# EAGLE design BURPS-v1.1 (EAGLE 5.12)
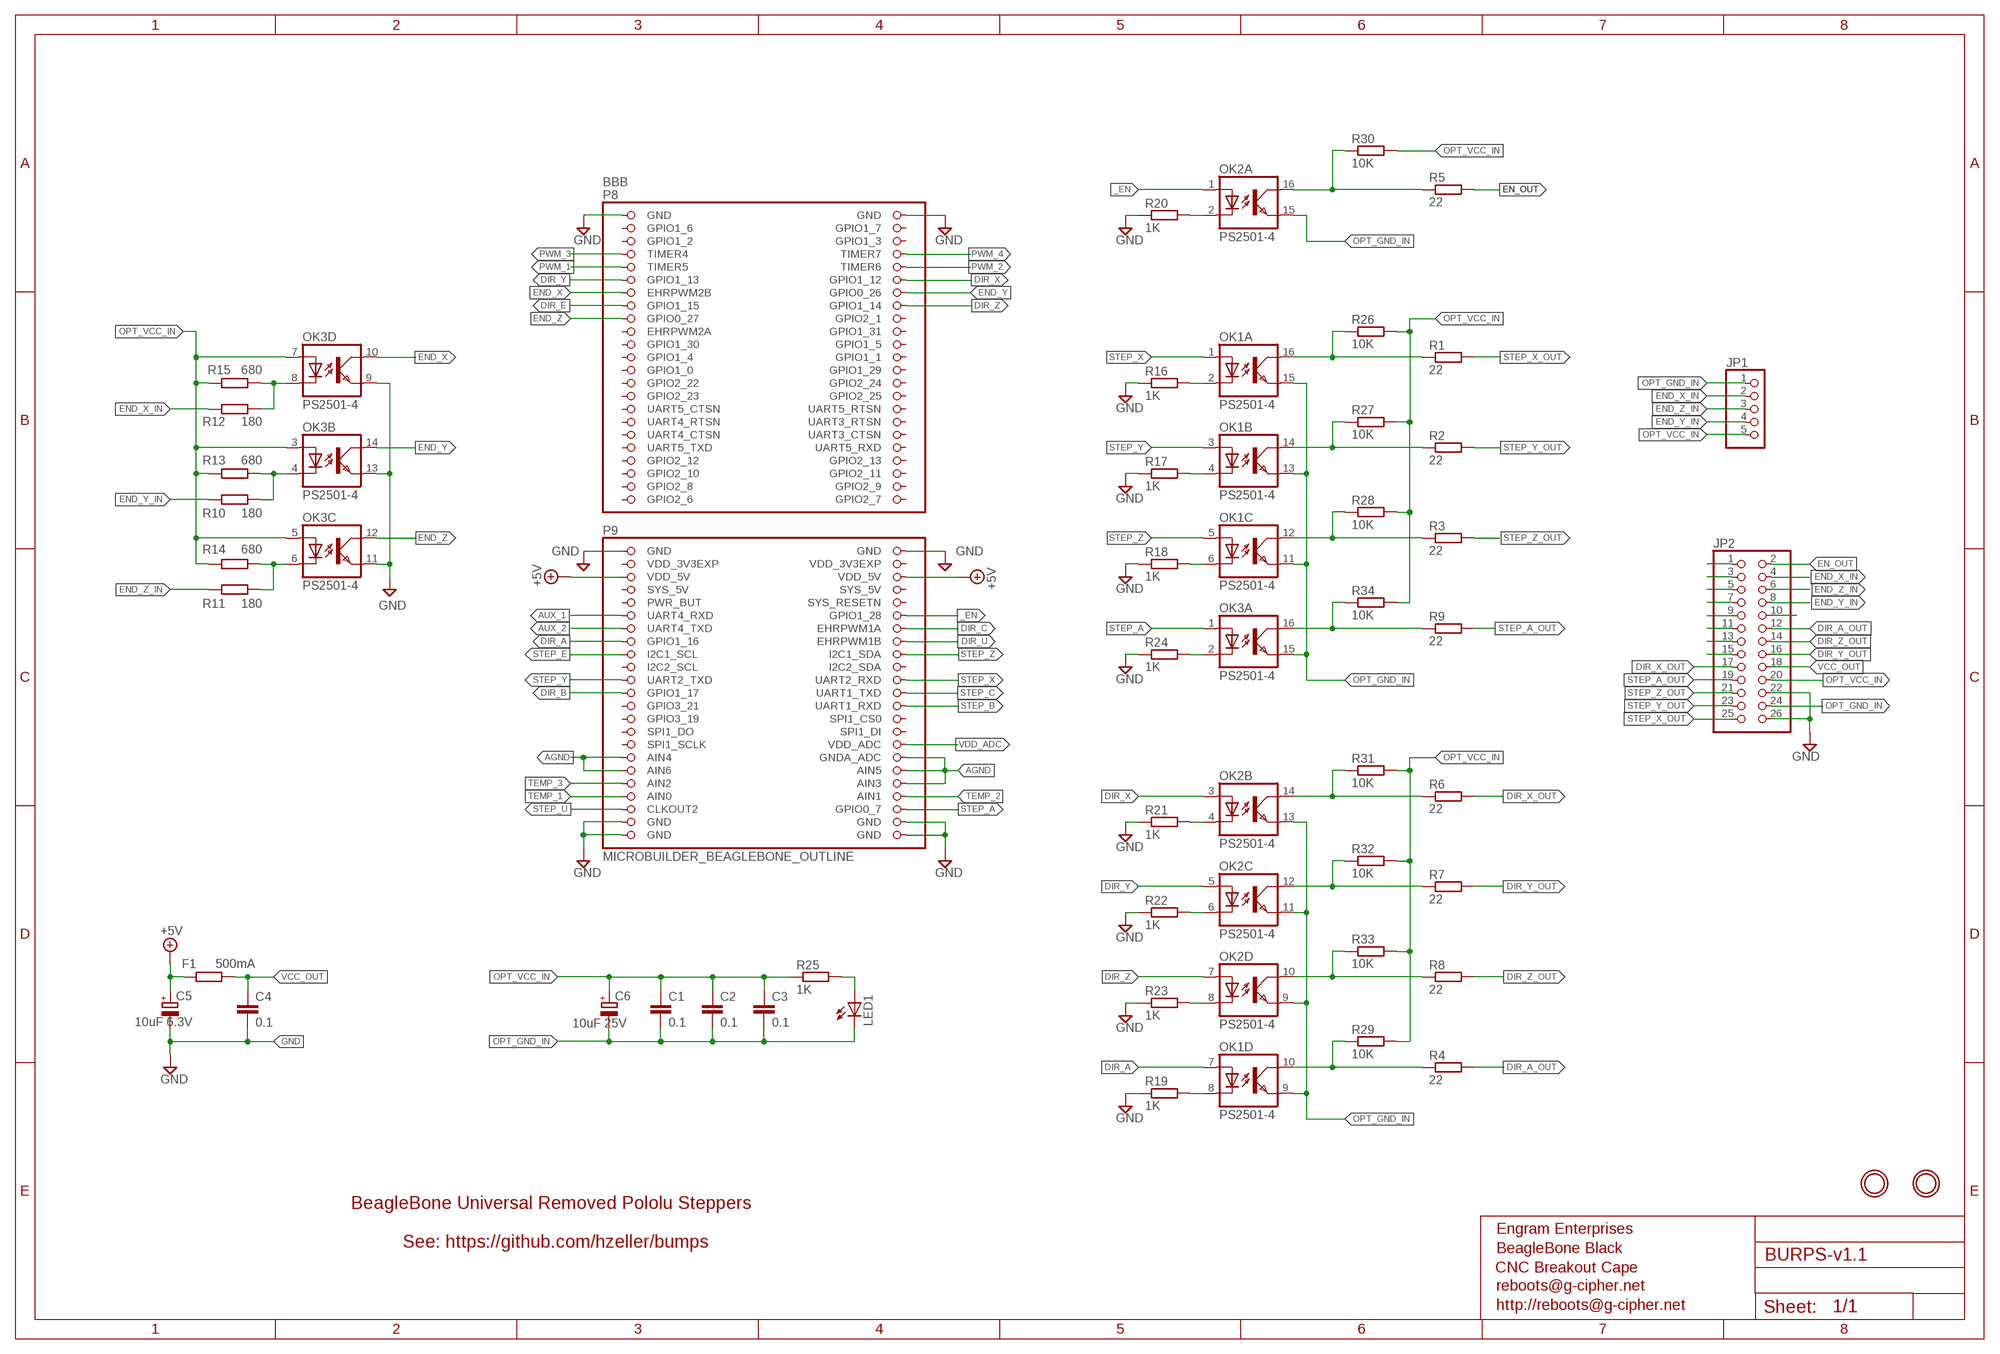
[diagram p0: schematic, sheet 1]

## Parts
BBB  MICROBUILDER_BEAGLEBONE_OUTLINE  [MICROBUILDER_BEAGLEBONE_SHIELD]
C1  0.1  C-EUC0805  [C0805]
C2  0.1  C-EUC0805  [C0805]
C3  0.1  C-EUC0805  [C0805]
C4  0.1  C-EUC0805  [C0805]
C5  10uF 6.3V  CPOL-EUC  [PANASONIC_C]
C6  10uF 25V  CPOL-EUC  [PANASONIC_C]
F1  500mA  R-EU_R1206  [R1206]
JP1  PINHD-1X5  [1X05]
JP2  PINHD-2X13  [2X13]
LED1  LEDCHIPLED_0805  [CHIPLED_0805]
OK1  PS2501-4  PC847  [DIL16]
OK2  PS2501-4  PC847  [DIL16]
OK3  PS2501-4  PC847  [DIL16]
R1  22  R-EU_R0805  [R0805]
R2  22  R-EU_R0805  [R0805]
R3  22  R-EU_R0805  [R0805]
R4  22  R-EU_R0805  [R0805]
R5  22  R-EU_R0805  [R0805]
R6  22  R-EU_R0805  [R0805]
R7  22  R-EU_R0805  [R0805]
R8  22  R-EU_R0805  [R0805]
R9  22  R-EU_R0805  [R0805]
R10  180  R-EU_R0805  [R0805]
R11  180  R-EU_R0805  [R0805]
R12  180  R-EU_R0805  [R0805]
R13  680  R-EU_R0805  [R0805]
R14  680  R-EU_R0805  [R0805]
R15  680  R-EU_R0805  [R0805]
R16  1K  R-EU_R0805  [R0805]
R17  1K  R-EU_R0805  [R0805]
R18  1K  R-EU_R0805  [R0805]
R19  1K  R-EU_R0805  [R0805]
R20  1K  R-EU_R0805  [R0805]
R21  1K  R-EU_R0805  [R0805]
R22  1K  R-EU_R0805  [R0805]
R23  1K  R-EU_R0805  [R0805]
R24  1K  R-EU_R0805  [R0805]
R25  1K  R-EU_R0805  [R0805]
R26  10K  R-EU_R0805  [R0805]
R27  10K  R-EU_R0805  [R0805]
R28  10K  R-EU_R0805  [R0805]
R29  10K  R-EU_R0805  [R0805]
R30  10K  R-EU_R0805  [R0805]
R31  10K  R-EU_R0805  [R0805]
R32  10K  R-EU_R0805  [R0805]
R33  10K  R-EU_R0805  [R0805]
R34  10K  R-EU_R0805  [R0805]
U$22  MOUNTINGHOLE3.0THIN  [MOUNTINGHOLE_3.0_PLATEDTHIN]
U$23  MOUNTINGHOLE3.0THIN  [MOUNTINGHOLE_3.0_PLATEDTHIN]

## Nets
+5V: BBB.51(VDD_5V) BBB.52(VDD_5V) C5.+ F1.1
_EN: BBB.58(GPIO1_28) OK2.1(A:A)
AGND: BBB.79(AIN4) BBB.80(GNDA_ADC) BBB.81(AIN6) BBB.82(AIN5) BBB.84(AIN3)
AUX_1: BBB.57(UART4_RXD)
AUX_2: BBB.59(UART4_TXD)
DIR_A: BBB.61(GPIO1_16) OK1.7(D:A)
DIR_A_OUT: JP2.12 R4.2
DIR_B: BBB.69(GPIO1_17)
DIR_C: BBB.60(EHRPWM1A)
DIR_E: BBB.15(GPIO1_15)
DIR_U: BBB.62(EHRPWM1B)
DIR_X: BBB.12(GPIO1_12) OK2.3(B:A)
DIR_X_OUT: JP2.17 R6.2
DIR_Y: BBB.11(GPIO1_13) OK2.5(C:A)
DIR_Y_OUT: JP2.16 R7.2
DIR_Z: BBB.16(GPIO1_14) OK2.7(D:A)
DIR_Z_OUT: JP2.14 R8.2
EN_OUT: JP2.2 R5.2
END_X: BBB.13(EHRPWM2B) OK3.10(D:COL)
END_X_IN: JP1.2 JP2.4 R12.1
END_Y: BBB.14(GPIO0_26) OK3.14(B:COL)
END_Y_IN: JP1.4 JP2.8 R10.1
END_Z: BBB.17(GPIO0_27) OK3.12(C:COL)
END_Z_IN: JP1.3 JP2.6 R11.1
GND: BBB.1(GND) BBB.2(GND) BBB.47(GND) BBB.48(GND) BBB.89(GND) BBB.90(GND) BBB.91(GND) BBB.92(GND) C4.2 C5.- JP2.22 JP2.26 OK3.9(D:EMIT) OK3.11(C:EMIT) OK3.13(B:EMIT) R16.1 R17.1 R18.1 R19.1 R20.1 R21.1 R22.1 R23.1 R24.1
IN1: JP2.9
IN2: JP2.13
IN3: JP2.15
IN6: JP2.10
N$1: OK3.2(A:C) R24.2
N$2: OK1.2(A:C) R16.2
N$3: OK1.4(B:C) R17.2
N$4: OK1.6(C:C) R18.2
N$5: OK2.4(B:C) R21.2
N$6: OK2.6(C:C) R22.2
N$7: OK2.8(D:C) R23.2
N$8: OK1.8(D:C) R19.2
N$9: OK3.6(C:C) R11.2 R14.2
N$10: LED1.A R25.2
N$11: OK2.2(A:C) R20.2
N$12: OK3.4(B:C) R10.2 R13.2
N$13: OK3.8(D:C) R12.2 R15.2
N$14: OK2.14(B:COL) R6.1 R31.1
N$15: OK2.12(C:COL) R7.1 R32.1
N$16: OK2.10(D:COL) R8.1 R33.1
N$17: OK1.10(D:COL) R4.1 R29.1
N$18: OK3.16(A:COL) R9.1 R34.1
N$19: OK1.16(A:COL) R1.1 R26.1
N$20: OK1.14(B:COL) R2.1 R27.1
N$21: OK1.12(C:COL) R3.1 R28.1
N$22: JP2.11
N$24: OK2.16(A:COL) R5.1 R30.1
OPT_GND_IN: C1.2 C2.2 C3.2 C6.- JP1.1 JP2.24 LED1.C OK1.9(D:EMIT) OK1.11(C:EMIT) OK1.13(B:EMIT) OK1.15(A:EMIT) OK2.9(D:EMIT) OK2.11(C:EMIT) OK2.13(B:EMIT) OK2.15(A:EMIT) OK3.15(A:EMIT)
OPT_VCC_IN: C1.1 C2.1 C3.1 C6.+ JP1.5 JP2.20 OK3.3(B:A) OK3.5(C:A) OK3.7(D:A) R13.1 R14.1 R15.1 R25.1 R26.2 R27.2 R28.2 R29.2 R30.2 R31.2 R32.2 R33.2 R34.2
OUT5: JP2.1
OUT6: JP2.3
OUT7: JP2.5
OUT8: JP2.7
PWM_1: BBB.9(TIMER5)
PWM_2: BBB.10(TIMER6)
PWM_3: BBB.7(TIMER4)
PWM_4: BBB.8(TIMER7)
STEP_A: BBB.88(GPIO0_7) OK3.1(A:A)
STEP_A_OUT: JP2.19 R9.2
STEP_B: BBB.72(UART1_RXD)
STEP_C: BBB.70(UART1_TXD)
STEP_E: BBB.63(I2C1_SCL)
STEP_U: BBB.87(CLKOUT2)
STEP_X: BBB.68(UART2_RXD) OK1.1(A:A)
STEP_X_OUT: JP2.25 R1.2
STEP_Y: BBB.67(UART2_TXD) OK1.3(B:A)
STEP_Y_OUT: JP2.23 R2.2
STEP_Z: BBB.64(I2C1_SDA) OK1.5(C:A)
STEP_Z_OUT: JP2.21 R3.2
TEMP_1: BBB.85(AIN0)
TEMP_2: BBB.86(AIN1)
TEMP_3: BBB.83(AIN2)
VCC_OUT: C4.1 F1.2 JP2.18
VDD_ADC: BBB.78(VDD_ADC)
Unconnected: BBB.5(GPIO1_2) BBB.6(GPIO1_3) BBB.18(GPIO2_1) BBB.19(EHRPWM2A) BBB.20(GPIO1_31) BBB.21(GPIO1_30) BBB.22(GPIO1_5) BBB.23(GPIO1_4) BBB.24(GPIO1_1) BBB.25(GPIO1_0) BBB.26(GPIO1_29) BBB.27(GPIO2_22) BBB.28(GPIO2_24) BBB.29(GPIO2_23) BBB.30(GPIO2_25) BBB.31(UART5_CTSN) BBB.32(UART5_RTSN) BBB.33(UART4_RTSN) BBB.34(UART3_RTSN) BBB.35(UART4_CTSN) BBB.36(UART3_CTSN) BBB.37(UART5_TXD) BBB.38(UART5_RXD) BBB.39(GPIO2_12) BBB.40(GPIO2_13) BBB.41(GPIO2_10) BBB.53(SYS_5V) BBB.54(SYS_5V) BBB.55(PWR_BUT) BBB.56(SYS_RESETN) BBB.65(I2C2_SCL) BBB.66(I2C2_SDA) BBB.71(GPIO3_21) BBB.73(GPIO3_19) BBB.74(SPI1_CS0) BBB.75(SPI1_DO) BBB.76(SPI1_DI) BBB.77(SPI1_SCLK)

## Notes on the sheet
- BeagleBone Universal Removed Pololu Steppers
- Engram Enterprises
- See: https://github.com/hzeller/bumps
- BeagleBone Black
- CNC Breakout Cape
- reboots@g-cipher.net
- http://reboots@g-cipher.net

## Power pins joined to a net without a drawn wire
GPIO1_6: BBB.3(GPIO1_6)
GPIO1_7: BBB.4(GPIO1_7)
GPIO2_6: BBB.45(GPIO2_6)
GPIO2_7: BBB.46(GPIO2_7)
GPIO2_8: BBB.43(GPIO2_8)
GPIO2_9: BBB.44(GPIO2_9)
GPIO2_11: BBB.42(GPIO2_11)
VDD_3V3EXP: BBB.49(VDD_3V3EXP) BBB.50(VDD_3V3EXP)

## Library data of the parts
BBB = BURPS-v0.1:MICROBUILDER_BEAGLEBONE_OUTLINE
C1-C4 = rcl:C-EU: CAPACITOR, European symbol
C5 C6 = rcl:CPOL-EU: POLARIZED CAPACITOR, European symbol
F1 R1-R34 = rcl:R-EU_: RESISTOR, European symbol
JP1 = pinhead:PINHD-1X5: PIN HEADER
JP2 = pinhead:PINHD-2X13: PIN HEADER
LED1 = led:LED: LED OSRAM: - CHIPLED LG R971, LG N971, LY N971, LG Q971, LY Q971, LO R971, LY R971 LH N974, LH R974 LS Q976, LO Q976, LY Q976 LO Q996 - Hyper CHIPLED LW Q18S LB Q993, LB Q99A, LB R99A - SideLED LS A670, LO A670, LY A670, LG A670, LP A670 LB A673, LV A673, LT A673, LW A673 LH A674 LY A675 LS A676, LA A676, LO A676, LY A676, LW A676 LS A679, LY A679, LG A679 - Hyper Micro SIDELED® LS Y876, LA Y876, LO Y876, LY Y876 LT Y87S - SmartLED LW L88C, LW L88S LB L89C, LB L89S, LG L890 LS L89K, LO L89K, LY L89K LS L896, LA L896, LO L896, LY L896 - TOPLED LS T670, LO T670, LY T670, LG T670, LP T670 LSG T670, LSP T670, LSY T670, LOP T670, LYG T670 LG T671, LOG T671, LSG T671 LB T673, LV T673, LT T673, LW T673 LH T674 LS T676, LA T676, LO T676, LY T676, LB T676, LH T676, LSB T676, LW T676 LB T67C, LV T67C, LT T67C, LS T67K, LO T67K, LY T67K, LW E67C LS E67B, LA E67B, LO E67B, LY E67B, LB E67C, LV E67C, LT E67C LW T67C LS T679, LY T679, LG T679 LS T770, LO T770, LY T770, LG T770, LP T770 LB T773, LV T773, LT T773, LW T773 LH T774 LS E675, LA E675, LY E675, LS T675 LS T776, LA T776, LO T776, LY T776, LB T776 LHGB T686 LT T68C, LB T68C - Hyper Mini TOPLED® LB M676 - Mini TOPLED Santana® LG M470 LS M47K, LO M47K, LY M47K Source: http://www.osram.convergy.de LUXEON: - LUMILED® LXK2-PW12-R00, LXK2-PW12-S00, LXK2-PW14-U00, LXK2-PW14-V00 LXK2-PM12-R00, LXK2-PM12-S00, LXK2-PM14-U00 LXK2-PE12-Q00, LXK2-PE12-R00, LXK2-PE12-S00, LXK2-PE14-T00, LXK2-PE14-U00 LXK2-PB12-K00, LXK2-PB12-L00, LXK2-PB12-M00, LXK2-PB14-N00, LXK2-PB14-P00, LXK2-PB14-Q00 LXK2-PR12-L00, LXK2-PR12-M00, LXK2-PR14-Q00, LXK2-PR14-R00 LXK2-PD12-Q00, LXK2-PD12-R00, LXK2-PD12-S00 LXK2-PH12-R00, LXK2-PH12-S00 LXK2-PL12-P00, LXK2-PL12-Q00, LXK2-PL12-R00 Source: www.luxeon.com KINGBRIGHT: KA-3528ASYC Source: www.kingbright.com
OK1-OK3 = optocoupler:PC847: SHARP OPTO COUPLER; OC_FARNELL: 9707735; OC_NEWARK: unknown
U$22 U$23 = microbuilder:MOUNTINGHOLE: Mounting Hole

## Board
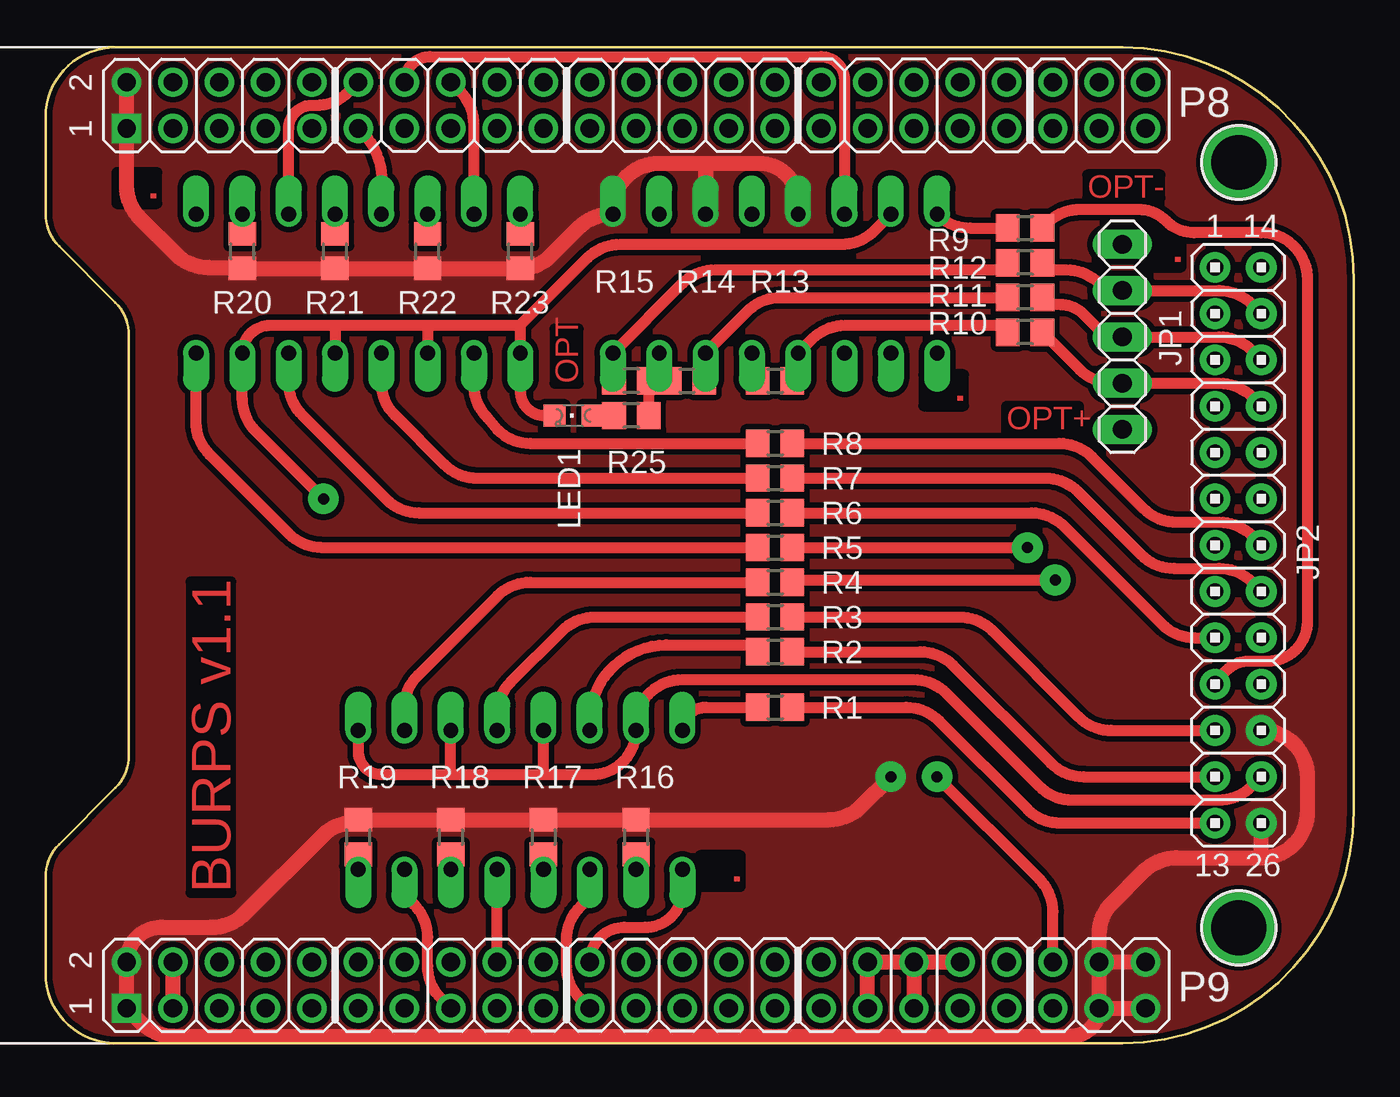
[diagram p1: board, top side]
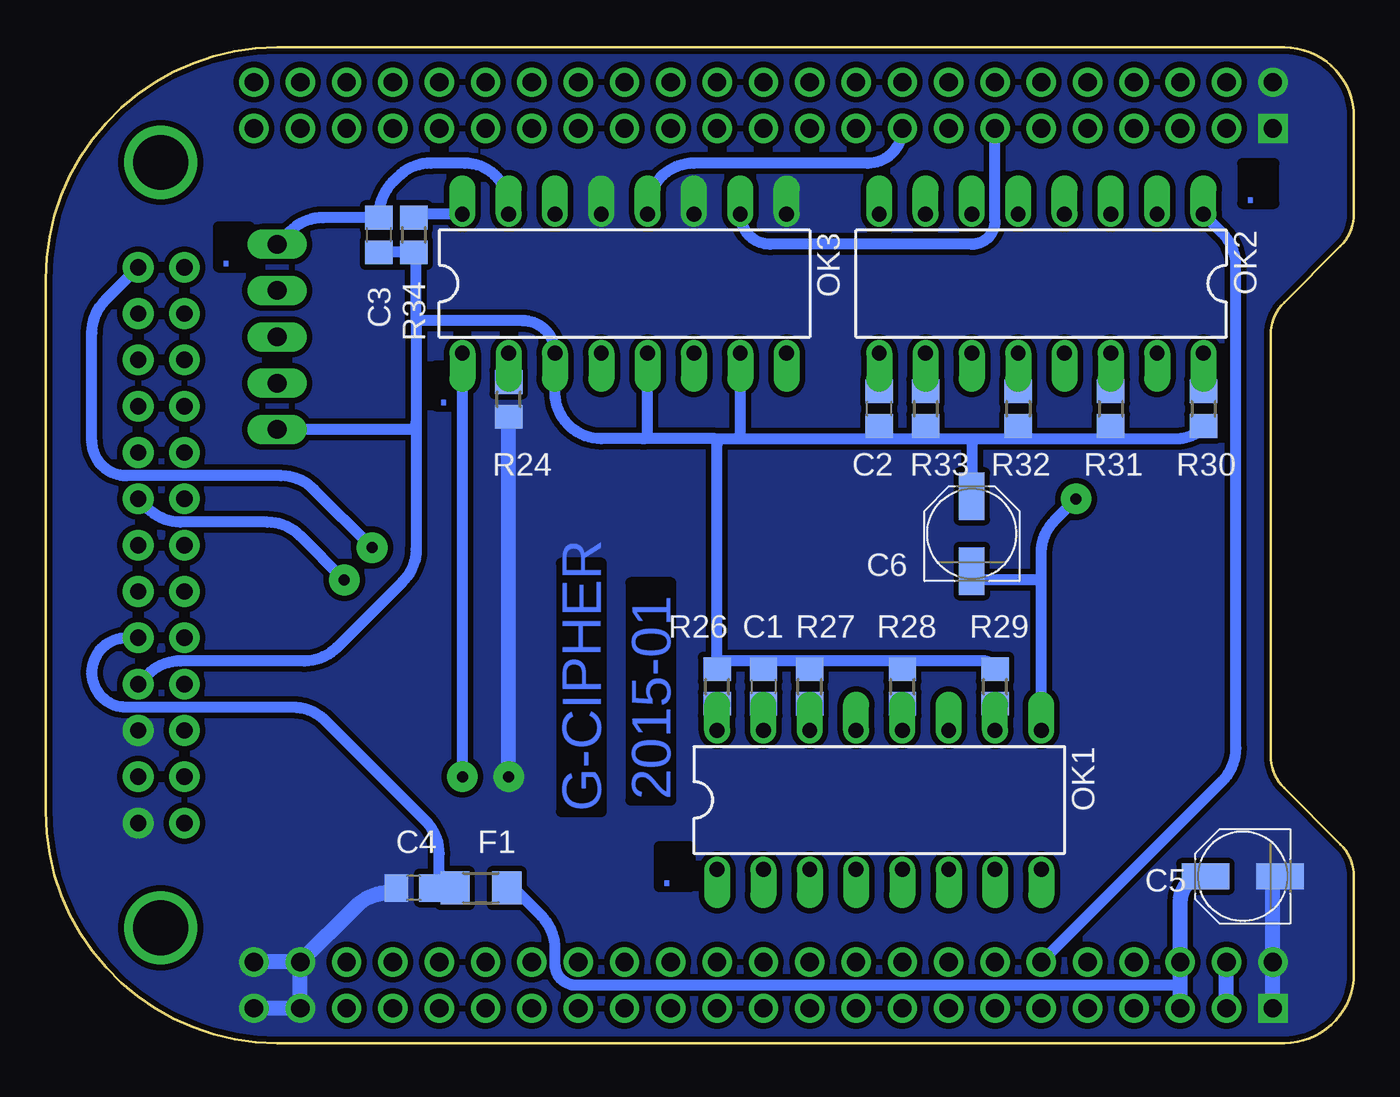
[diagram p2: board, bottom side, seen from below]

Size 71.75 x 54.61 mm. Coordinates in mm from the lower left corner, seen from the top.
Outline: 3.81,54.61 59.05,54.61 arc-90 71.75,41.91 71.75,12.7 arc-90 59.05,0 3.81,0 arc-90 0,3.81 0,9.11 arc-45 0.74,10.9 3.83,13.99 arc45 4.57,15.78 4.57,38.83 arc45 3.83,40.62 0.74,43.71 arc-45 0,45.5 0,50.8 arc-90 3.81,54.61
Copper layers (1*16): Top 0.035mm / dielectric 1.5mm / Bottom 0.035mm
Design rules "SparkFun10mil": minimum track width 10mil, minimum drill 20mil, track to track 10mil, track to pad 10mil, pad to pad 10mil, via to via 10mil, smd to smd 10mil, copper to edge 10mil, drill to drill 10mil, minimum pad ring 12mil, minimum via ring 10mil, stop-mask expansion 4mil, vias tented up to drill 25mil, thermal gap 10mil

### Footprints (pad centres in the part's own frame; a part is rotated, then mirrored left to right if it is on the bottom)
MICROBUILDER_BEAGLEBONE_SHIELD = drill 1 square: 1 4.445,19.05; 47 52.705,19.05 | drill 1 round: 2 1.905,19.05; 3 4.445,21.59; 4 1.905,21.59; 5 4.445,24.13; 6 1.905,24.13; 7 4.445,26.67; 8 1.905,26.67; 9 4.445,29.21; 10 1.905,29.21; 11 4.445,31.75; 12 1.905,31.75; 13 4.445,34.29; 14 1.905,34.29; 15 4.445,36.83; 16 1.905,36.83; 17 4.445,39.37; 18 1.905,39.37; 19 4.445,41.91; 20 1.905,41.91; 21 4.445,44.45; 22 1.905,44.45; 23 4.445,46.99; 24 1.905,46.99; 25 4.445,49.53; 26 1.905,49.53; 27 4.445,52.07; 28 1.905,52.07; 29 4.445,54.61; 30 1.905,54.61; 31 4.445,57.15; 32 1.905,57.15; 33 4.445,59.69; 34 1.905,59.69; 35 4.445,62.23; 36 1.905,62.23; 37 4.445,64.77; 38 1.905,64.77; 39 4.445,67.31; 40 1.905,67.31; 41 4.445,69.85; 42 1.905,69.85; 43 4.445,72.39; 44 1.905,72.39; 45 4.445,74.93; 46 1.905,74.93; 48 50.165,19.05; 49 52.705,21.59; 50 50.165,21.59; 51 52.705,24.13; 52 50.165,24.13; 53 52.705,26.67; 54 50.165,26.67; 55 52.705,29.21; 56 50.165,29.21; 57 52.705,31.75; 58 50.165,31.75; 59 52.705,34.29; 60 50.165,34.29; 61 52.705,36.83; 62 50.165,36.83; 63 52.705,39.37; 64 50.165,39.37; 65 52.705,41.91; 66 50.165,41.91; 67 52.705,44.45; 68 50.165,44.45; 69 52.705,46.99; 70 50.165,46.99; 71 52.705,49.53; 72 50.165,49.53; 73 52.705,52.07; 74 50.165,52.07; 75 52.705,54.61; 76 50.165,54.61; 77 52.705,57.15; 78 50.165,57.15; 79 52.705,59.69; 80 50.165,59.69; 81 52.705,62.23; 82 50.165,62.23; 83 52.705,64.77; 84 50.165,64.77; 85 52.705,67.31; 86 50.165,67.31; 87 52.705,69.85; 88 50.165,69.85; 89 52.705,72.39; 90 50.165,72.39; 91 52.705,74.93; 92 50.165,74.93
C0805 = smd 1.3 x 1.5: 1 -0.95,0; 2 0.95,0
PANASONIC_C = smd 2.6 x 1.4: + 2.05,0; - -2.05,0
R1206 = smd 1.6 x 1.803: 1 -1.422,0; 2 1.422,0
1X05 = drill 1.016 long: 1 -5.08,0; 2 -2.54,0; 3 0,0; 4 2.54,0; 5 5.08,0
2X13 = drill 0.9 pad 1.676 round: 1 -15.24,-1.27; 2 -15.24,1.27; 3 -12.7,-1.27; 4 -12.7,1.27; 5 -10.16,-1.27; 6 -10.16,1.27; 7 -7.62,-1.27; 8 -7.62,1.27; 9 -5.08,-1.27; 10 -5.08,1.27; 11 -2.54,-1.27; 12 -2.54,1.27; 13 0,-1.27; 14 0,1.27; 15 2.54,-1.27; 16 2.54,1.27; 17 5.08,-1.27; 18 5.08,1.27; 19 7.62,-1.27; 20 7.62,1.27; 21 10.16,-1.27; 22 10.16,1.27; 23 12.7,-1.27; 24 12.7,1.27; 25 15.24,-1.27; 26 15.24,1.27
CHIPLED_0805 = smd 1.2 x 1.2: A 0,-1.05; C 0,1.05
DIL16 = drill 0.813 offset: 1 -8.89,-3.81; 2 -6.35,-3.81; 3 -3.81,-3.81; 4 -1.27,-3.81; 5 1.27,-3.81; 6 3.81,-3.81; 7 6.35,-3.81; 8 8.89,-3.81; 9 8.89,3.81; 10 6.35,3.81; 11 3.81,3.81; 12 1.27,3.81; 13 -1.27,3.81; 14 -3.81,3.81; 15 -6.35,3.81; 16 -8.89,3.81
R0805 = smd 1.3 x 1.5: 1 -0.95,0; 2 0.95,0
MOUNTINGHOLE_3.0_PLATEDTHIN@1 = drill 3 pad 3.6 round: P$1 0,0

### Placement (x,y rotation side)
BBB  -14.61,54.61 270 top
C1  32.39,19.56 270 bottom
C2  26.04,34.8 90 bottom
C3  53.47,44.32 90 bottom
C4  51.56,8.51 180 bottom
C5  6.1,9.14 180 bottom
C6  20.96,27.94 90 bottom
F1  47.88,8.51 180 bottom
JP1  59.05,38.73 270 top
JP2  65.41,27.31 270 top
LED1  28.96,34.42 90 top
OK1  26.04,13.34 0 bottom
OK2  17.14,41.66 180 bottom
OK3  40,41.66 0 bottom
R1  40,18.41 0 top
R2  40,21.46 0 top
R3  40,23.37 0 top
R4  40,25.27 0 top
R5  40,27.18 0 top
R6  40,29.08 0 top
R7  40,30.99 0 top
R8  40,32.89 0 top
R9  53.72,44.7 0 top
R10  53.72,38.99 180 top
R11  53.72,40.89 180 top
R12  53.72,42.8 180 top
R13  40,36.32 0 top
R14  35.18,36.32 0 top
R15  32.13,36.32 180 top
R16  32.39,11.3 270 top
R17  27.3,11.3 270 top
R18  22.22,11.3 270 top
R19  17.14,11.3 270 top
R20  10.79,43.43 90 top
R21  15.88,43.43 90 top
R22  20.96,43.43 90 top
R23  26.04,43.43 90 top
R24  46.36,35.31 90 bottom
R25  32.13,34.42 180 top
R26  34.92,19.56 90 bottom
R27  29.85,19.56 90 bottom
R28  24.76,19.56 90 bottom
R29  19.68,19.56 90 bottom
R30  8.25,34.8 270 bottom
R31  13.34,34.8 270 bottom
R32  18.42,34.8 270 bottom
R33  23.5,34.8 270 bottom
R34  51.56,44.32 270 bottom
U$22  MOUNTINGHOLE3.0THIN  [MOUNTINGHOLE_3.0_PLATEDTHIN@1]  65.44,48.3 0 top
U$23  MOUNTINGHOLE3.0THIN  [MOUNTINGHOLE_3.0_PLATEDTHIN@1]  65.44,6.32 0 top

### Tracks (layer width: path | path; a pad name or v marks a point on that pad's centre or on a via)
+5V
  Bottom 0.61: 9.52,3.17 42.67,3.17 arc90 43.81,4.32 43.81,5.17 arc-45 44.56,6.97 45.85,8.26 arc-45 F1.1
  Bottom 0.813: BBB.51 9.52,3.17 BBB.52 9.52,7.76 arc90 C5.+
_EN
  Bottom 0.61: BBB.58 7.22,14.37 arc-45 6.48,16.16 6.48,42.64 arc-45 7.22,44.43 OK2.1
AGND
  Top 0.813: BBB.79 BBB.80 BBB.82 | BBB.82 BBB.81 | BBB.82 BBB.84
DIR_A
  Top 0.61: BBB.61 21.7,2.43 arc-45 20.96,4.23 20.96,5.81 arc45 20.21,7.6 19.68,8.13 OK1.7
DIR_A_OUT  (via drill 0.6 pad 1.68)
  Top 0.61: R4.2 arc-45 41.26,25.4 v55.37,25.4
  Bottom 0.61: v55.37,25.4 57.8,27.83 arc-45 59.6,28.57 64.35,28.57 arc45 66.14,29.32 JP2.12
DIR_X
  Top 0.61: BBB.12 16.62,52.18 arc-45 14.82,51.44 14.61,51.44 arc90 13.34,50.16 OK2.3
DIR_X_OUT
  Top 0.61: R6.2 54.07,29.08 arc-45 55.86,28.34 61.23,22.97 arc45 63.02,22.23 JP2.17
DIR_Y
  Top 0.61: BBB.11 17.67,49.64 arc-45 18.42,46.83 OK2.5
DIR_Y_OUT
  Top 0.61: R7.2 54.83,30.99 arc-45 56.62,30.24 60.09,26.78 arc45 61.88,26.04 64.36,26.04 arc-45 66.15,25.29 JP2.16
DIR_Z
  Top 0.61: BBB.16 22.75,52.18 arc-45 23.5,50.38 OK2.7
DIR_Z_OUT
  Top 0.61: R8.2 55.59,32.89 arc-45 57.39,32.15 60.22,29.32 arc45 62.01,28.57 64.36,28.57 arc-45 66.15,27.83 JP2.14
EN_OUT  (via drill 0.6 pad 1.68)
  Top 0.61: R5.2 v53.85,27.18
  Bottom 0.61: v53.85,27.18 57.04,30.37 arc-45 58.84,31.11 67.31,31.11 arc90 69.21,33.02 69.21,38.96 arc45 68.47,40.75 JP2.2
END_X
  Bottom 0.61: OK3.10 arc-90 32,43.81 20.96,43.81 arc-90 19.68,45.09 BBB.13
END_X_IN
  Top 0.61: R12.1 arc90 55.05,42.42 55.97,42.42 arc-45 57.77,41.67 58.17,41.27 JP1.2 64.36,41.27 arc-45 66.15,40.53 JP2.4
END_Y
  Top 0.61: BBB.14 arc-90 21.08,54.1 42.55,54.1 arc-90 43.81,52.83 OK3.14
END_Y_IN
  Top 0.61: R10.1 56.72,36.94 arc45 58.52,36.2 JP1.4 64.36,36.2 arc-45 66.15,35.45 JP2.8
END_Z
  Bottom 0.61: BBB.17 arc90 26.67,48.26 36.19,48.26 arc-90 38.73,45.72 OK3.12
END_Z_IN
  Top 0.61: R11.1 arc90 55.05,40.51 55.63,40.51 arc-45 56.93,39.97 58.17,38.73 JP1.3 64.36,38.73 arc-45 66.15,37.99 JP2.6
GND  (via drill 0.6 pad 1.68)
  Top 0.61: 31.11,45.72 OK3.9 31.02,45.47 | 16.77,12.06 17.14,12.06 R19.1
  Top 0.813: BBB.2 BBB.1 4.45,47.03 arc45 5.19,45.23 7.13,43.29 arc45 8.93,42.55 10.65,42.55 arc-45 R20.1 R21.1 R22.1 R23.1 arc45 27.67,43.16 29.23,44.72 arc-45 31.02,45.47 | OK3.13 41.28,46.1 arc90 39.12,48.26 36.19,48.26 | 36.19,48.26 OK3.11 | 31.11,45.72 arc-90 33.66,48.26 36.19,48.26 | BBB.89 arc-90 56.26,0.38 7.02,0.38 arc-45 5.22,1.12 BBB.47 BBB.48 arc-90 6.35,6.35 9.11,6.35 arc45 10.9,7.09 15.24,11.43 arc-45 16.77,12.06 | BBB.89 BBB.91 | BBB.89 BBB.90 | BBB.90 BBB.92 | R19.1 R18.1 R17.1 R16.1 42.95,12.25 arc45 44.75,13 v46.36,14.61 | BBB.90 57.78,5.93 arc-45 58.53,7.73 60.22,9.42 arc-45 62.01,10.16 66.67,10.16 | 66.67,10.16 arc90 69.21,12.7 69.21,14.61 arc90 JP2.22 | 66.67,10.16 JP2.26
  Bottom 0.813: v46.36,14.61 R24.1 | BBB.90 BBB.92 | BBB.90 BBB.89 BBB.91 | BBB.90 54.72,7.51 arc45 52.92,8.26 52.45,8.26 | 4.45,9.14 BBB.48 BBB.47
  pour Top (isolate 0.305, no thermals): 3.81,0 59.05,0 arc90 71.75,12.7 71.75,41.91 arc90 59.05,54.61 3.81,54.61 arc90 0,50.8 0,45.5 arc45 0.74,43.71 3.83,40.62 arc-45 4.57,38.83 4.57,15.78 arc-45 3.83,13.99 0.74,10.9 arc45 0,9.11 0,3.81 arc90
  pour Bottom (isolate 0.305, no thermals): 3.81,54.61 59.05,54.61 arc-90 71.75,41.91 71.75,12.7 arc-90 59.05,0 3.81,0 arc-90 0,3.81 0,9.11 arc-45 0.74,10.9 3.83,13.99 arc45 4.57,15.78 4.57,38.83 arc45 3.83,40.62 0.74,43.71 arc-45 0,45.5 0,50.8 arc-90
N$1
  Bottom 0.813: R24.2 OK3.2
N$2
  Top 0.61: OK1.2 R16.2
N$3
  Top 0.61: OK1.4 R17.2
N$4
  Top 0.61: OK1.6 R18.2
N$5
  Top 0.61: OK2.4 R21.2
N$6
  Top 0.61: OK2.6 R22.2
N$7
  Top 0.61: OK2.8 R23.2
N$8
  Top 0.61: OK1.8 R19.2
N$9
  Top 0.61: R14.2 arc90 36.19,35.88 OK3.6 38.5,40.15 arc-45 40.3,40.89 R11.2
N$10
  Top 0.61: LED1.A R25.2
N$11
  Top 0.61: R20.2 OK2.2
N$12
  Top 0.61: R13.2 arc90 41.28,36.26 OK3.4 42.05,38.63 arc-45 43.85,39.37 52.39,39.37 arc-90 R10.2
N$13
  Top 0.61: R15.2 arc-90 31.11,35.88 OK3.8 34.94,41.67 arc-45 36.74,42.42 52.39,42.42 arc90 R12.2
N$14
  Top 0.61: R6.1 20.48,29.08 arc-45 18.69,29.83 14.08,34.44 arc-45 13.34,36.23 OK2.14
  Bottom 0.61: OK2.14 R31.1
N$15
  Top 0.61: R7.1 23.66,30.99 arc-45 21.86,31.73 19.16,34.44 arc-45 18.42,36.23 OK2.12
  Bottom 0.61: OK2.12 R32.1
N$16
  Top 0.61: R8.1 26.58,32.89 arc-45 24.78,33.64 24.24,34.31 arc-45 23.5,36.1 OK2.10
  Bottom 0.61: OK2.10 R33.1
N$17
  Top 0.61: R4.1 26.58,25.27 arc45 24.78,24.53 20.43,20.18 arc45 19.68,18.38 OK1.10
  Bottom 0.61: OK1.10 R29.1
N$18
  Top 0.61: OK3.16 48.91,45.45 arc45 50.71,44.7 R9.1
  Bottom 0.61: 49.15,45.47 OK3.16 51.37,45.47 arc-90 R34.1
N$19
  Top 0.61: R1.1 36.19,18.41 arc90 OK1.16
  Bottom 0.61: OK1.16 R26.1
N$20
  Top 0.61: OK1.14 29.85,17.53 arc-90 34.04,21.84 38.73,21.84 38.73,21.78 arc90 R2.1
  Bottom 0.61: OK1.14 R27.1
N$21
  Top 0.61: R3.1 30.14,23.37 arc45 28.34,22.62 25.51,19.79 arc45 24.76,18 OK1.12
  Bottom 0.61: OK1.12 R28.1
N$24
  Top 0.61: OK2.16 8.25,34.07 arc45 9,32.28 13.35,27.92 arc45 15.15,27.18 R5.1
  Bottom 0.61: OK2.16 R30.1
OPT_GND_IN  (via drill 0.6 pad 1.68)
  Top 0.61: 15.88,39.37 12.32,39.37 arc90 OK2.15 10.79,35.34 arc45 11.54,33.55 v15.24,29.84 | 15.88,39.37 20.96,39.37 | 20.96,39.37 26.04,39.37 | 15.88,39.37 OK2.13 | 20.96,39.37 OK2.11 | 26.04,39.37 OK2.9 C2.2 arc90 27.37,34.42 LED1.C | 26.04,39.37 29.74,43.07 arc-45 31.53,43.81 43.65,43.81 arc45 45.45,44.56 OK3.15 | OK1.9 17.14,16 arc90 18.42,14.73 22.22,14.73 | 22.22,14.73 OK1.11 | 27.3,14.73 OK1.13 | 22.22,14.73 27.3,14.73 | 27.3,14.73 29.97,14.73 arc90 OK1.15 32.39,17.4 arc-90 34.92,19.94 47.59,19.94 arc-45 49.39,19.2 54.5,14.08 arc45 56.3,13.34 64.35,13.34 arc45 66.14,14.08 JP2.24
  Bottom 0.61: OK1.9 17.14,25.4 | 17.14,25.4 17.14,26.89 arc45 16.4,28.68 v15.24,29.84 | OK3.15 46.36,45.85 arc-90 48.77,48.26 50.64,48.26 arc-45 52.43,47.52 52.72,47.23 arc-45 53.47,45.43 C3.2 56.55,45.27 arc-45 58.34,44.53 JP1.1 | C6.- arc-90 20.46,25.4 17.14,25.4 | OK2.9 C2.2 | OK1.15 C1.2
OPT_VCC_IN
  Top 0.61: 33.66,36.32 R15.1 | OK3.7 33.66,36.32 | 33.66,36.32 33.66,36.07 | 33.91,36.07 R14.1 | 33.66,36.07 arc-90 33.91,36.07 | 33.66,36.32 33.91,36.07 | R13.1 arc-90 38.73,36.26 OK3.5 | R25.1 33.08,35.49 arc-90 33.66,36.07
  Bottom 0.61: 33.66,33.15 OK3.7 | 35.05,33.15 33.66,33.15 | 35.05,33.15 38.99,33.15 | 38.99,33.15 41.28,33.15 arc90 43.81,35.69 OK3.3 arc-90 45.59,39.62 51.44,39.62 | OK3.5 38.73,33.4 arc90 38.99,33.15 | 33.66,33.15 26.04,33.15 | 26.04,33.15 23.56,33.15 arc-90 R33.2 23.5,33.15 20.96,33.15 | 18.42,33.15 13.21,33.15 | 20.96,33.15 18.42,33.15 | 18.42,33.15 R32.2 | 35.05,33.15 arc45 34.92,32.84 R26.2 34.92,20.95 31.94,20.95 | 51.44,39.62 51.44,34.04 | 51.44,34.04 51.44,27.09 arc45 52.18,25.29 55.77,21.7 arc45 57.57,20.95 64.36,20.95 arc-45 66.15,20.21 JP2.20 | 29.97,20.95 24.64,20.95 24.64,20.82 arc45 R28.2 24.76,20.95 20.25,20.95 arc45 19.94,20.83 arc-45 19.89,20.71 R29.2 | 29.97,20.95 R27.2 arc45 29.97,20.82 29.97,20.95 | 13.21,33.15 R31.2 | 13.21,33.15 9.88,33.15 arc-45 8.21,33.76 R30.2 | 20.96,33.15 C6.+ | 26.04,33.15 C2.1 | 31.94,20.95 arc-90 C1.1 | 29.97,20.95 31.94,20.95 | 51.44,39.62 51.44,43.18 arc90 51.56,43.31 R34.2 C3.1 | JP1.5 51.82,33.66 arc-90 51.44,34.04
STEP_A  (via drill 0.6 pad 1.68)
  Top 0.61: BBB.88 55.24,7.2 arc45 54.5,9 v48.89,14.61
  Bottom 0.61: v48.89,14.61 OK3.1
STEP_A_OUT
  Top 0.61: R9.2 54.94,44.98 arc-45 56.74,45.72 59.94,45.72 arc-45 61.47,45.09 61.49,45.07 arc45 62.97,44.45 66.67,44.45 arc-90 69.21,41.91 69.21,23.11 arc-90 67.06,20.95 66,20.95 arc45 64.77,20.45 64.22,19.9 arc45 JP2.19
STEP_X
  Top 0.61: BBB.68 arc-90 31.75,6.35 32.89,6.35 arc90 34.92,8.38 OK1.1
STEP_X_OUT
  Top 0.61: R1.2 47.21,18.41 arc-45 49,17.67 53.86,12.81 arc45 55.66,12.07 JP2.25
STEP_Y
  Top 0.61: BBB.67 29.29,2.46 arc-45 28.57,4.19 28.57,5.68 arc-45 29.32,7.47 29.85,8 OK1.3
STEP_Y_OUT
  Top 0.61: R2.2 47.97,21.46 arc-45 49.77,20.72 55.13,15.35 arc45 56.93,14.61 JP2.23
STEP_Z
  Top 0.61: BBB.64 OK1.5
STEP_Z_OUT
  Top 0.61: R3.2 50.13,23.37 arc-45 51.92,22.62 56.66,17.89 arc45 58.45,17.15 JP2.21
VCC_OUT
  Bottom 0.61: C4.1 F1.2 arc90 50.16,9.37 50.16,10.38 arc-45 50.91,12.17 56.41,17.67 arc-45 58.2,18.41 67.31,18.41 arc90 69.21,20.32 arc90 67.31,22.23 JP2.18 arc-90 JP2.18
VDD_3V3EXP
  Top 0.813: BBB.49 BBB.50
  Bottom 0.813: BBB.49 BBB.50

### Text on the board
Top: . | OPT- | . | OPT | . | OPT+ | . | BURPS v1.1
Bottom: . | . | . | 2015-01 | G-CIPHER | .
tPlace: 2 | P8 | 1 | 1 | 14 | 13 | 26 | 2 | 1 | P9